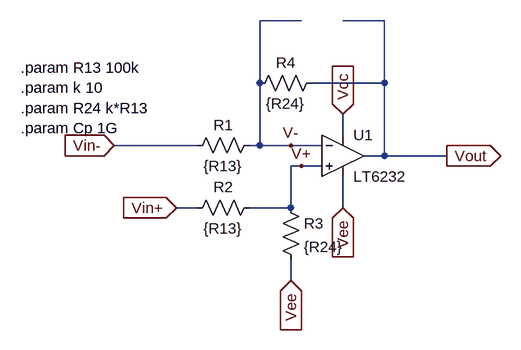
[diagram p0: schematic OpAmpDifferential.asc]
OpAmpDifferential.asc, the LTspice schematic file:
Version 4
SHEET 1 880 680
WIRE -96 -272 -160 -272
WIRE 32 -272 -32 -272
WIRE -160 -176 -160 -272
WIRE 32 -176 32 -272
WIRE 32 -176 -80 -176
WIRE -32 -96 -32 -128
WIRE -256 -80 -384 -80
WIRE -160 -80 -160 -176
WIRE -160 -80 -176 -80
WIRE -112 -80 -160 -80
WIRE -64 -80 -112 -80
WIRE 32 -64 32 -176
WIRE 32 -64 0 -64
WIRE 128 -64 32 -64
WIRE -96 -48 -112 -48
WIRE -64 -48 -96 -48
WIRE -256 16 -288 16
WIRE -112 16 -112 -48
WIRE -112 16 -176 16
WIRE -32 16 -32 -32
WIRE -112 128 -112 96
FLAG -288 16 Vin+
IOPIN -288 16 In
FLAG -384 -80 Vin-
IOPIN -384 -80 In
FLAG -112 -80 V-
FLAG -96 -48 V+
FLAG -32 -128 Vcc
IOPIN -32 -128 In
FLAG -32 16 Vee
IOPIN -32 16 In
FLAG 128 -64 Vout
IOPIN 128 -64 Out
FLAG -112 128 Vee
IOPIN -112 128 In
SYMBOL res -272 -64 R270
WINDOW 0 32 56 VTop 2
WINDOW 3 0 56 VBottom 2
SYMATTR InstName R1
SYMATTR Value {R13}
SYMBOL res -272 32 R270
WINDOW 0 32 56 VTop 2
WINDOW 3 0 56 VBottom 2
SYMATTR InstName R2
SYMATTR Value {R13}
SYMBOL res -128 0 R0
SYMATTR InstName R3
SYMATTR Value {R24}
SYMBOL res -64 -192 R90
WINDOW 0 0 56 VBottom 2
WINDOW 3 32 56 VTop 2
SYMATTR InstName R4
SYMATTR Value {R24}
SYMBOL Opamps\\LT6232 -32 -64 R0
SYMATTR InstName U1
TEXT -528 -200 Left 2 !.param R13 100k\n.param k 10\n.param R24 k*R13\n.param Cp 1G

The netlist it stands for:
* OpAmpDifferential.asc
R1 Vin- V- {R13}
R2 Vin+ V+ {R13}
R3 V+ Vee {R24}
R4 Vout V- {R24}
* U1: LT6232 (symbol Opamps\LT6232 not available, pins judged from their places): In+=V+ In-=V- V+=Vcc V-=Vee OUT=Vout
.param R13 100k
.param k 10
.param R24 k*R13
.param Cp 1G
.backanno
.end